# EasyEDA Pro project ProDoc_PCB5_2024-10-30.epro

# Board PCB5
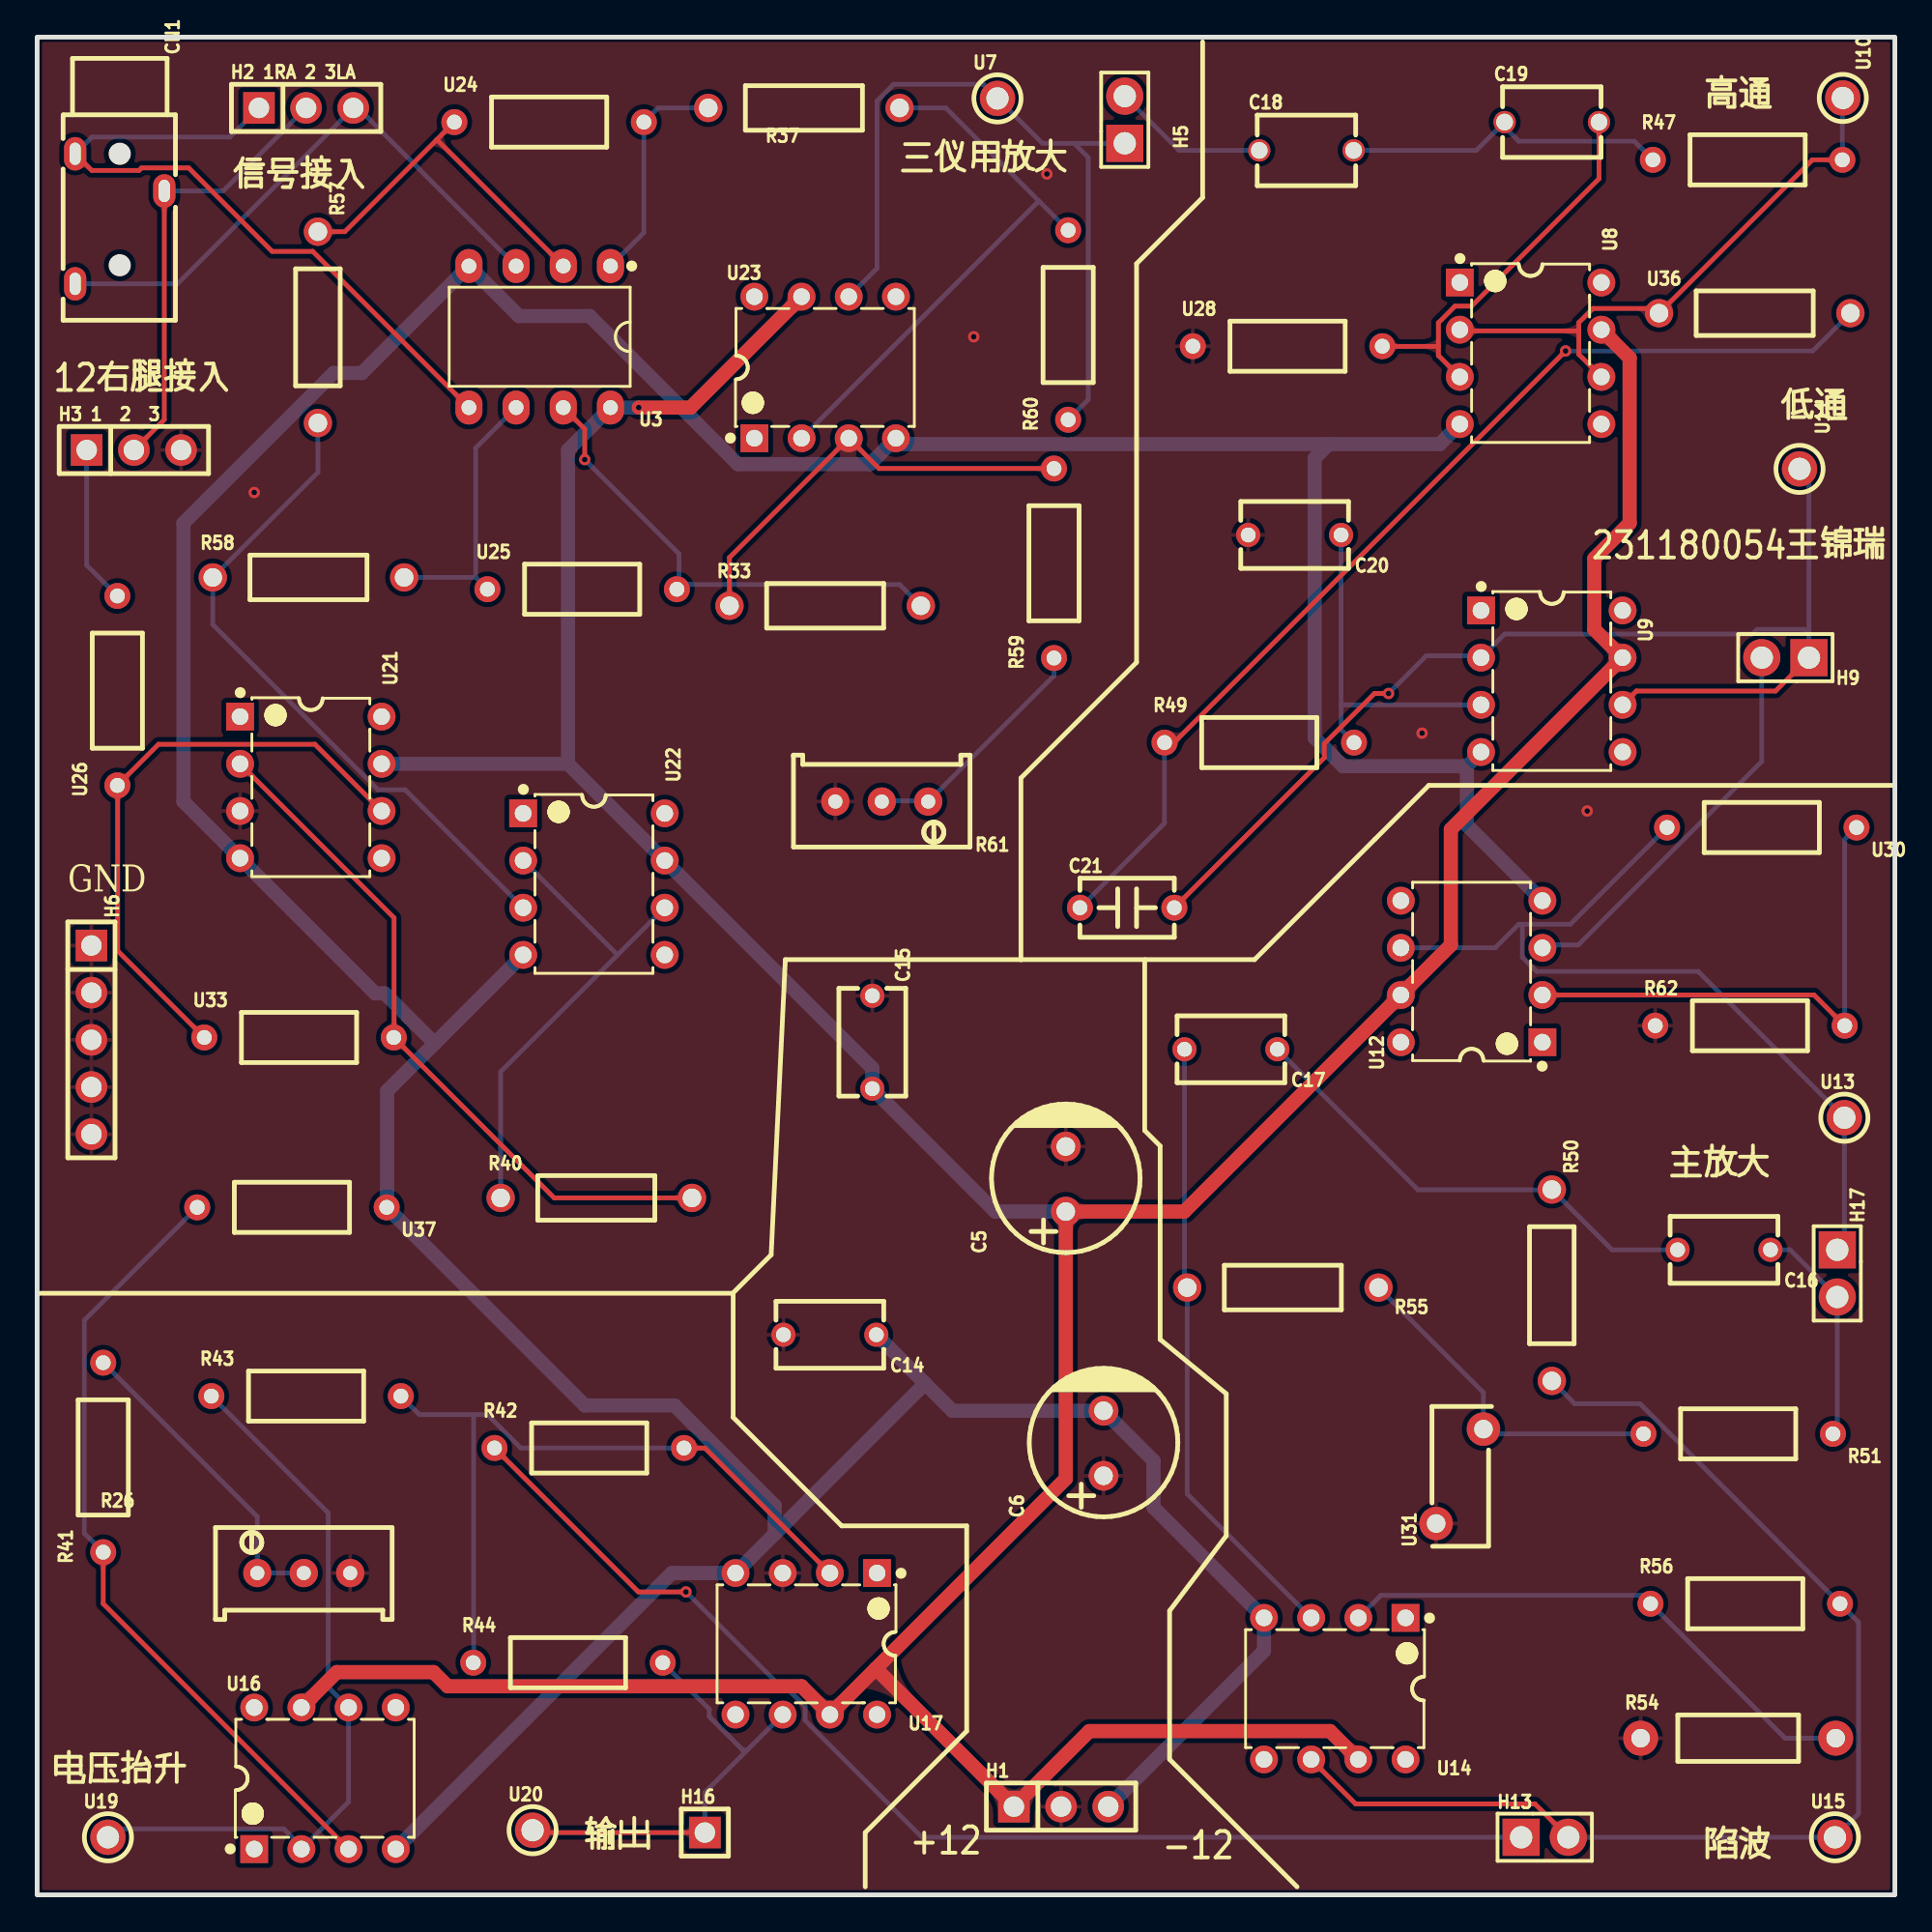
[diagram p0: board, top side]
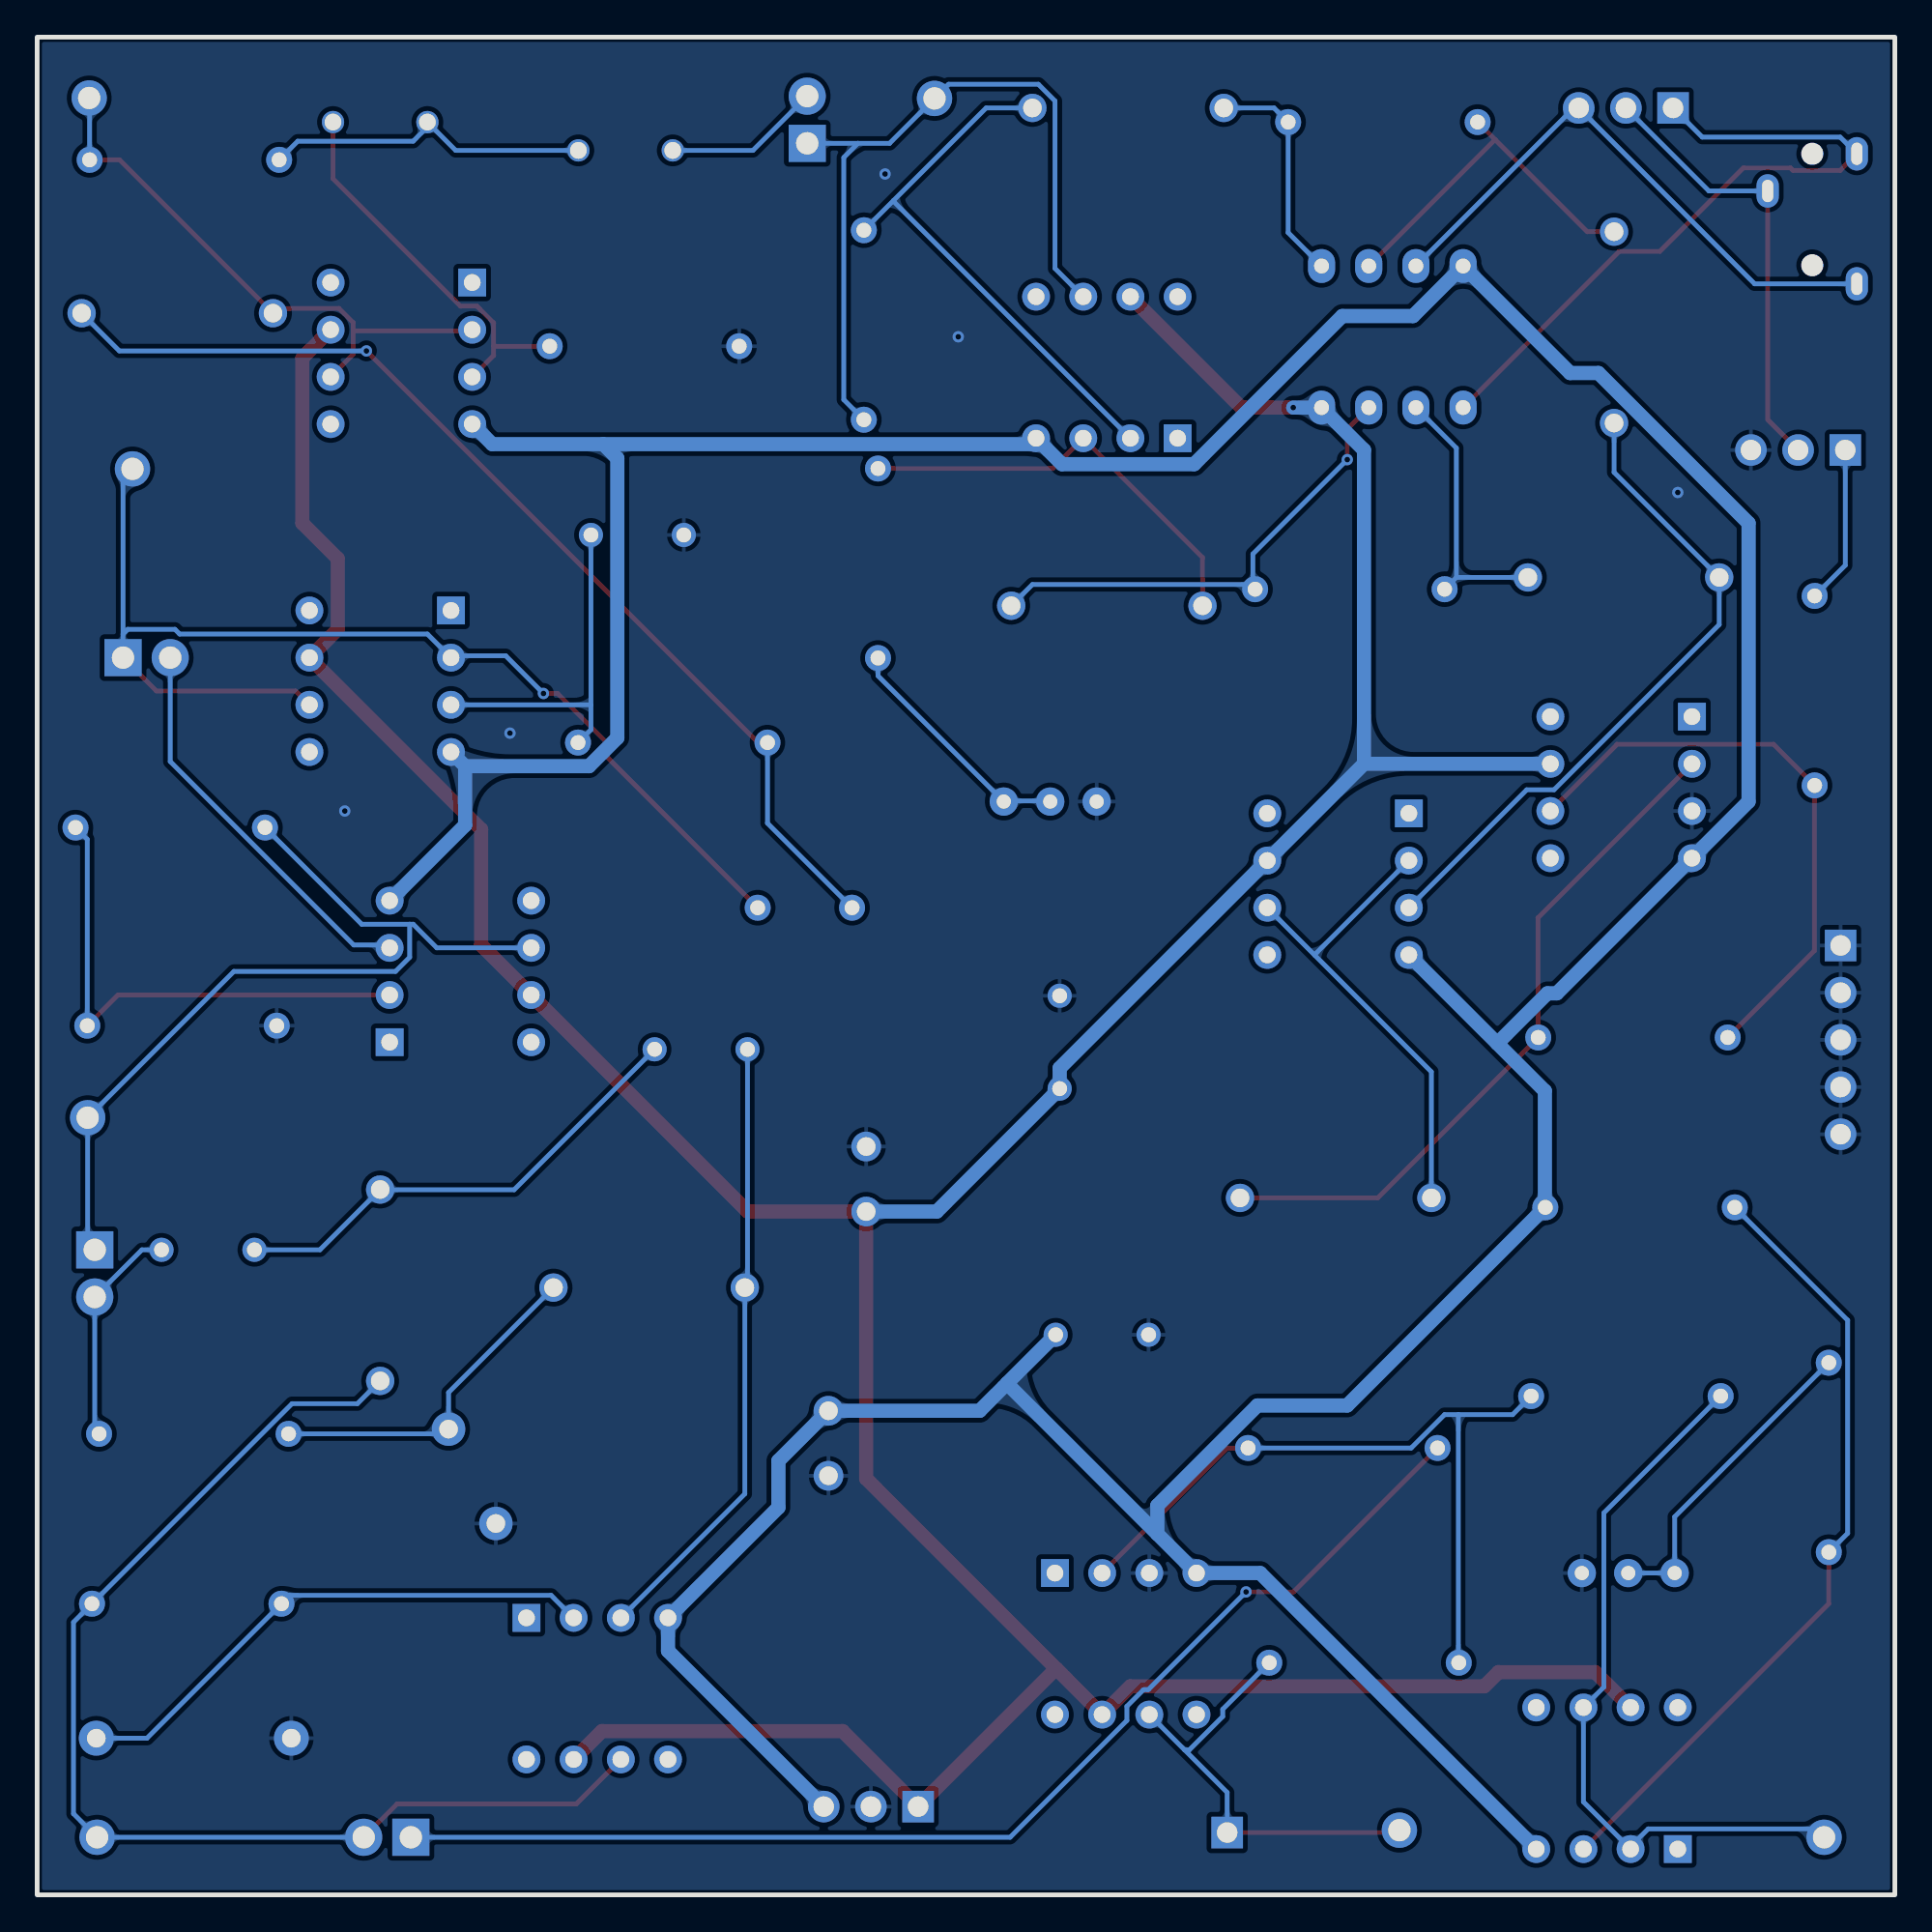
[diagram p1: board, bottom side, seen from below]

Outline 100 x 100 mm; copper layers: Top Layer, Bottom Layer. Coordinates in mm from the lower left corner of the outline.
Outline path: rectangle 0,100 100,0
Stack: Top Layer 0.035mm / Dielectric1 1.51mm FR4 er 4.5 / Bottom Layer 0.035mm

## Design rules (mm)
template: 自定义配置
spacing copperThickness1oz (default): track to track 0.102, other pairs 0.152 to 0.3
spacing copperThickness2oz: track to track 0.203, other pairs 0.152 to 0.3
track width copperThickness1oz (default): min 0.127, default 0.254, max 2.54
track width copperThickness2oz: min 0.203, default 0.254, max 2.54
track width 电源: min 0.762, default 0.762, max 0.762
differential pair differentialPair (default): width min 0.127, default 0.254, max 2.54; gap min 0.152, default 0.152
via viaSize (default): diameter min 0.5, default 0.61, max 10; hole min 0.3, default 0.305, max 6.299
net +12V uses 电源
net -12V uses 电源

## Placement (name value [footprint] x y rotation side)
C5  10uF  [CAP-TH_BD8.0-P3.50-D0.6-FD]  55.37 38.53 90 top
C6  10uF  [CAP-TH_BD8.0-P3.50-D0.6-FD]  57.4 24.31 90 top
C14  100nF  [CAP-TH_L5.8-W3.6-P5.0-D0.6]  42.67 30.15 180 top
C15  100nF  [CAP-TH_L5.8-W3.6-P5.0-D0.6]  44.96 45.9 270 top
C16  100nF  [CAP-TH_L5.8-W3.6-P5.0-D0.6]  90.8 34.72 180 top
C17  100nF  [CAP-TH_L5.8-W3.6-P5.0-D0.6]  64.26 45.52 180 top
C18  680nF  [CAP-TH_L5.3-W3.8-P5.08-D0.5]  68.33 93.9 0 top
C19  680nF  [CAP-TH_L5.3-W3.8-P5.08-D0.5]  81.53 95.43 0 top
C20  100nF  [CAP-TH_L5.8-W3.6-P5.0-D0.6]  67.69 73.2 180 top
C21  220nF  [CAP-TH_L5.0-W2.5-P5.08-D0.7]  58.67 53.14 0 top
CN1  PJ-3200  [AUDIO-TH_PJ-3200]  4.45 90.22 270 top
H1  PZ254V-11-03P  [HDR-TH_3P-P2.54-V-M]  55.12 4.75 0 top
H2 1RA 2 3LA  PZ254V-11-03P  [HDR-TH_3P-P2.54-V-M]  14.48 96.19 0 top
H3 1  2  3  -  [HDR-TH_3P-P2.54-V-M]  5.21 77.77 0 top
H5  PZ254V-11-02P  [HDR-TH_2P-P2.54-V-M]  58.55 95.55 90 top
H6  PZ254V-11-05P  [HDR-TH_5P-P2.54-V-M]  2.92 46.02 270 top
H9  PZ254V-11-02P  [HDR-TH_2P-P2.54-V-M]  94.11 66.6 180 top
H13  PZ254V-11-02P  [HDR-TH_2P-P2.54-V-M]  81.15 3.1 0 top
H16  PZ254V-11-01P  [HDR-TH_1P-P2.54-V-M]  35.94 3.35 0 top
H17  PZ254V-11-02P  [HDR-TH_2P-P2.54-V-M]  96.9 33.45 270 top
R26  10kΩ  [RES-ADJ-TH_3P-L10.0-W10.0-P2.50-L]  14.35 17.32 0 top
R33  10kΩ  [RES-TH_BD2.4-L6.3-P10.30-D0.6]  42.42 69.39 0 top
R37  10kΩ  [RES-TH_BD2.4-L6.3-P10.30-D0.6]  41.27 96.19 180 top
R40  10kΩ  [RES-TH_BD2.4-L6.3-P10.30-D0.6]  30.1 37.52 0 top
R41  20kΩ  [RES-TH_BD2.7-L6.2-P10.20-D0.4]  3.56 23.55 90 top
R42  1kΩ  [RES-TH_BD2.7-L6.2-P10.20-D0.4]  29.72 24.05 0 top
R43  1kΩ  [RES-TH_BD2.7-L6.2-P10.20-D0.4]  14.48 26.85 0 top
R44  1kΩ  [RES-TH_BD2.7-L6.2-P10.20-D0.4]  28.58 12.5 0 top
R47  1.8MΩ  [RES-TH_BD2.7-L6.2-P10.20-D0.4]  92.08 93.4 0 top
R49  13kΩ  [RES-TH_BD2.7-L6.2-P10.20-D0.4]  65.79 62.03 0 top
R50  16kΩ  [RES-TH_BD2.4-L6.3-P10.30-D0.6]  81.53 32.82 270 top
R51  33kΩ  [RES-TH_BD2.7-L6.2-P10.20-D0.4]  91.57 24.82 180 top
R54  3.9kΩ  [RES-TH_BD2.5-L6.5-P10.50-D0.6]  91.57 8.43 0 top
R55  30kΩ  [RES-TH_BD2.4-L6.3-P10.30-D0.6]  67.06 32.69 180 top
R56  3.3kΩ  [RES-TH_BD2.7-L6.2-P10.20-D0.4]  91.95 15.67 0 top
R57  10kΩ  [RES-TH_BD2.4-L6.3-P10.30-D0.6]  15.11 84.38 270 top
R58  10kΩ  [RES-TH_BD2.4-L6.3-P10.30-D0.6]  14.61 70.92 0 top
R59  20kΩ  [RES-TH_BD2.7-L6.2-P10.20-D0.4]  54.74 71.68 90 top
R60  20kΩ  [RES-TH_BD2.7-L6.2-P10.20-D0.4]  55.5 84.51 90 top
R61  10kΩ  [RES-ADJ-TH_3P-L10.0-W10.0-P2.50-L]  45.47 58.85 180 top
R62  1.5kΩ  [RES-TH_BD2.7-L6.2-P10.20-D0.4]  92.2 46.79 0 top
U3  LM358P  [DIP-8_L9.4-W6.4-P2.54-LS9.1-BL]  27.05 83.87 180 top
U7  RH-5000  [TEST-TH_BD2.54-P1.4_RED]  51.7 96.7 0 top
U8  OP07CP  [DIP-8_L9.6-W6.4-P2.54-LS7.6-BL-1]  80.39 82.98 270 top
U9  OP07CP  [DIP-8_L9.6-W6.4-P2.54-LS7.6-BL-1]  81.53 65.33 270 top
U10  RH-5000  [TEST-TH_BD2.54-P1.4_RED]  97.2 96.73 270 top
U11  RH-5000  [TEST-TH_BD2.54-P1.4_RED]  94.87 76.76 270 top
U12  OP07CP  [DIP-8_L9.6-W6.4-P2.54-LS7.6-BL-1]  77.22 49.71 90 top
U13  RH-5000  [TEST-TH_BD2.54-P1.4_RED]  97.28 41.83 0 top
U14  OP07CP  [DIP-8_L9.6-W6.4-P2.54-LS7.6-BL-1]  69.85 11.1 180 top
U15  RH-5000  [TEST-TH_BD2.54-P1.4_RED]  96.77 3.1 0 top
U16  OP07CP  [DIP-8_L9.6-W6.4-P2.54-LS7.6-BL-1]  15.49 6.27 0 top
U17  OP07CP  [DIP-8_L9.6-W6.4-P2.54-LS7.6-BL-1]  41.4 13.51 180 top
U19  RH-5000  [TEST-TH_BD2.54-P1.4_RED]  3.81 3.1 0 top
U20  RH-5000  [TEST-TH_BD2.54-P1.4_RED]  26.67 3.48 0 top
U21  OP07CP  [DIP-8_L9.6-W6.4-P2.54-LS7.6-BL-1]  14.73 59.61 270 top
U22  OP07CP  [DIP-8_L9.6-W6.4-P2.54-LS7.6-BL-1]  29.97 54.41 270 top
U23  OP07CP  [DIP-8_L9.6-W6.4-P2.54-LS7.6-BL-1]  42.42 82.22 0 top
U24  100kΩ  [RES-TH_BD2.7-L6.2-P10.20-D0.4]  27.56 95.43 0 top
U25  100kΩ  [RES-TH_BD2.7-L6.2-P10.20-D0.4]  29.34 70.28 0 top
U26  100kΩ  [RES-TH_BD2.7-L6.2-P10.20-D0.4]  4.32 64.82 90 top
U28  5.6MΩ  [RES-TH_BD2.7-L6.2-P10.20-D0.4]  67.31 83.36 0 top
U30  47kΩ  [RES-TH_BD2.7-L6.2-P10.20-D0.4]  92.84 57.45 180 top
U31  220nF  [CAP-TH_L7.5-W3.2-P5.08-D0.6]  76.58 22.53 90 top
U33  1MΩ  [RES-TH_BD2.7-L6.2-P10.20-D0.4]  14.1 46.15 0 top
U36  12kΩ  [RES-TH_BD2.4-L6.3-P10.30-D0.6]  92.46 85.14 0 top
U37  130kΩ  [RES-TH_BD2.7-L6.2-P10.20-D0.4]  13.72 37.01 180 top

## Footprints (pads in the part's own frame, mm; a bottom-side part is the same pattern mirrored in y, then rotated)
AUDIO-TH_PJ-3200
  oval 1.8x1.2 hole 1.2x0.6: 2(-1.5,2.4) 3(-3.5,-2.4) 4(3.5,-2.4)
CAP-TH_BD8.0-P3.50-D0.6-FD
  round 1.6 hole 1: 1(-1.75,0) 2(1.75,0)
CAP-TH_L5.0-W2.5-P5.08-D0.7
  round 1.4 hole 0.8: 1(-2.54,0) 2(2.54,0)
CAP-TH_L5.3-W3.8-P5.08-D0.5
  round 1.2 hole 0.9: 1(-2.54,0) 2(2.54,0)
CAP-TH_L5.8-W3.6-P5.0-D0.6
  round 1.3 hole 0.8: 1(-2.5,0) 2(2.5,0)
CAP-TH_L7.5-W3.2-P5.08-D0.6
  round 1.8 hole 1: 1(-2.54,1.274) 2(2.54,-1.274)
DIP-8_L9.4-W6.4-P2.54-LS9.1-BL
  oval 1.46x1.825 hole 0.8: 1(-3.81,-3.81) 2(-1.27,-3.81) 3(1.27,-3.81) 4(3.81,-3.81) 5(3.81,3.81) 6(1.27,3.81) 7(-1.27,3.81) 8(-3.81,3.81)
DIP-8_L9.6-W6.4-P2.54-LS7.6-BL-1
  rect 1.5x1.5 hole 0.9: 1(-3.81,-3.81)
  round 1.5 hole 0.9: 2(-1.27,-3.81) 3(1.27,-3.81) 4(3.81,-3.81) 5(3.81,3.81) 6(1.27,3.81) 7(-1.27,3.81) 8(-3.81,3.81)
HDR-TH_1P-P2.54-V-M
  rect 1.7x1.7 hole 1.1: 1(0,0)
HDR-TH_2P-P2.54-V-M
  rect 2x2 hole 1.2: 1(-1.27,0)
  round 2 hole 1.2: 2(1.27,0)
HDR-TH_3P-P2.54-V-M
  rect 1.7x1.7 hole 1.1: 1(-2.54,0)
  round 1.7 hole 1.1: 2(0,0) 3(2.54,0)
HDR-TH_5P-P2.54-V-M
  rect 1.7x1.7 hole 1.1: 1(-5.08,0)
  round 1.7 hole 1.1: 2(-2.54,0) 3(0,0) 4(2.54,0) 5(5.08,0)
RES-ADJ-TH_3P-L10.0-W10.0-P2.50-L
  round 1.524 hole 0.762: 1(-2.5,0) 2(0,0) 3(2.5,0)
RES-TH_BD2.4-L6.3-P10.30-D0.6
  round 1.524 hole 1: 1(-5.15,0) 2(5.15,0)
RES-TH_BD2.5-L6.5-P10.50-D0.6
  round 1.879 hole 1: 1(-5.25,0) 2(5.25,0)
RES-TH_BD2.7-L6.2-P10.20-D0.4
  round 1.4 hole 0.8: 1(-5.1,0) 2(5.1,0)
TEST-TH_BD2.54-P1.4_RED
  round 1.9 hole 1.2: 1(0,0)

## Nets
+12V: C5.1 C15.2 H1.1 U3.8 U8.7 U9.7 U12.7 U14.7 U16.7 U17.7 U21.7 U22.7 U23.7
-12V: C6.2 C14.1 H1.3 U3.4 U8.4 U9.4 U12.4 U14.4 U16.4 U17.4 U21.4 U22.4 U23.4 U37.1
GND: C5.2 C6.1 C14.2 C15.1 C20.2 H1.2 H3 1  2  3.3 H6.1 H6.2 H6.3 H6.4 H6.5 R26.3 R54.1 R61.3 R62.1 U17.3 U21.3 U28.1 U31.1
$1N1302: CN1.2 H2 1RA 2 3LA.2 H3 1  2  3.2
$1N1303: CN1.4 H2 1RA 2 3LA.3 U3.3
$1N1305: R37.1 R60.2 U23.2
$1N1306: H5.1 R60.1 U7.1 U23.6
$1N1308: R37.2 U3.1 U24.2
$1N1309: R57.1 U3.2 U24.1
$1N1310: R33.2 U3.7 U25.2
$1N1312: R33.1 R59.2 U23.3
$1N1313: R59.1 R61.1 R61.2
$1N1314: R57.2 R58.1 U22.3
$1N1315: R40.1 U22.2 U22.6
$1N1317: R40.2 U21.2 U33.2
$1N1318: H3 1  2  3.1 U26.2
$1N1319: U21.6 U26.1 U33.1
$1N1321: R58.2 U3.6 U25.1
$1N1327: CN1.3 H2 1RA 2 3LA.1 U3.5
$1N1922: C18.1 H5.2
$1N1923: C19.2 U8.3 U28.2
$1N1927: C18.2 C19.1 R47.1
$1N1933: R47.2 U8.2 U8.6 U10.1 U36.1
$1N1934: C21.2 H9.1 U9.2 U9.6 U11.1
$1N1935: C21.1 R49.1 U36.2
$1N1937: C20.1 R49.2 U9.3
$1N2912: H9.2 U12.3
$1N2915: R62.2 U12.2 U30.1
$1N2917: R51.2 R55.1 U31.2
$1N2918: C16.2 C17.1 R50.1
$1N2919: C17.2 R55.2 U14.3
$1N2920: R54.2 R56.1 U14.2
$1N2921: H13.2 R50.2 R56.2 U14.6 U15.1
$1N4245: R41.1 U16.3 U37.2
$1N4250: R26.1 R26.2 R41.2
$1N4251: R43.1 U16.2 U16.6 U19.1
$1N4261: H13.1 R42.1
$1N4264: R42.2 R43.2 R44.1 U17.2
$1N4272: H16.1 R44.2 U17.6 U20.1
$1N8474: C16.1 H17.2 R51.1
$1N8480: H17.1 U12.6 U13.1 U30.2

Pads without a net: U8 1 5 8; U9 1 5 8; U12 1 5 8; U14 1 5 8; U16 1 5 8; U17 1 5 8; U21 1 5 8; U22 1 5 8; U23 1 5 8

## Via types
v1: diameter 0.61, hole 0.305, Top Layer to Bottom Layer, 10 vias

## Routing (per net, layer and track width the routed paths; a pad name or vN(x,y) marks a point on that pad's centre or on a via; arc(x,y) is an arc through that point)
+12V: length 239.9
  Top Layer w0.762: v1(32.39,80.06) 35.18,80.06 U23.7 ; 45.13,12.17 45.16,12.17 H1.1 56.64,8.81 69.6,8.81 U14.7 ; 45.13,12.17 U17.7 41.15,11.23 22.1,11.23 21.34,11.99 16.13,11.99 U16.7 ; 45.13,12.17 55.37,22.4 C5.1 61.75,36.78 U12.7 76.1,51.13 76.1,57.35 U9.7 83.82,68.12 83.82,71.93 85.73,73.84 85.73,82.73 84.2,84.25
  Bottom Layer w0.762: 28.58,60.88 28.58,77.77 U3.8 v1(32.39,80.06) ; 28.58,60.88 U21.7 ; 28.58,60.88 U22.7 44.96,44.5 C15.2 51.57,36.78 C5.1
-12V: length 275.9
  Bottom Layer w0.762: H1.3 66.04,13.13 U14.4 60.1,20.85 60.1,23.36 C6.2 49.26,26.06 47.78,27.54 ; 18.84,36.98 29.48,26.34 34.31,26.34 39.7,20.95 39.7,19.43 ; 18.84,36.98 18.84,43.27 21.4,45.83 ; 18.84,36.98 U37.1 ; 45.91,78.09 44.83,77.01 37.72,77.01 29.75,84.99 25.94,84.99 U3.4 17.48,81.92 15.96,81.92 7.87,73.84 7.87,58.85 U21.4 18.2,48.53 18.7,48.53 21.4,45.83 ; 45.91,78.09 69.53,78.09 ; 45.91,78.09 U23.4 ; 39.7,19.43 47.78,27.51 47.78,27.54 ; 39.7,19.43 U17.4 34.16,17.32 U16.4 ; 76.96,60.76 70.29,60.76 68.77,62.28 68.77,77.33 69.53,78.09 ; 76.96,60.76 U9.4 ; 76.96,60.76 76.96,57.58 U12.4 ; 76.58,79.17 75.5,78.09 69.53,78.09 ; 21.4,45.83 U22.4 ; 47.78,27.54 C14.1
GND:
  vias: v1(11.68,75.49) v1(50.42,83.87) v1(54.36,92.63) v1(74.55,62.53) v1(83.44,58.34)
$1N1302: length 24.1
  Top Layer w0.254: CN1.2 6.84,79.41 H3 1  2  3.2
  Bottom Layer w0.254: H2 1RA 2 3LA.2 10.01,91.72 CN1.2
$1N1303: length 31.2
  Bottom Layer w0.254: CN1.4 7.55,86.72 H2 1RA 2 3LA.3 17.27,96.19 U3.3
$1N1305: length 29.9
  Bottom Layer w0.254: U23.2 53.9,91.16 53.9,91.21 ; 53.9,91.21 R60.2 ; 53.9,91.21 48.92,96.19 R37.1
$1N1306: length 41.8
  Bottom Layer w0.254: 55.82,94.28 56.58,93.52 56.58,80.49 R60.1 ; 55.82,94.28 54.11,94.28 U7.1 50.93,97.46 46.11,97.46 45.21,96.57 45.21,87.55 U23.6 ; 55.82,94.28 H5.1
$1N1308: length 12.3
  Bottom Layer w0.254: U3.1 32.66,89.48 U24.2 33.42,96.19 36.13,96.19
$1N1309: length 19.4
  Top Layer w0.254: 21.5,94.47 21.53,94.47 U3.2 ; 21.5,94.47 16.56,89.53 R57.1 ; 21.5,94.47 22.46,95.43
$1N1310: length 26
  Top Layer w0.254: U3.7 29.48,78.91 v1(29.48,77.26)
  Bottom Layer w0.254: 34.56,70.4 34.56,72.18 v1(29.48,77.26) ; 34.56,70.4 U25.2 ; 34.56,70.4 34.69,70.54 46.42,70.54 R33.2
$1N1312: length 23.4
  Top Layer w0.254: R59.2 45.32,76.78 U23.3 37.27,71.99 R33.1
$1N1313: length 13.1
  Bottom Layer w0.254: R59.1 54.74,65.62 48,58.89 ; 48,58.89 R61.1 ; 48,58.89 45.5,58.89 R61.2
$1N1314: length 36.2
  Bottom Layer w0.254: R57.2 15.11,76.57 R58.1 9.45,68.38 18.34,59.49 19.81,59.49 U22.3
$1N1315: length 26.5
  Bottom Layer w0.254: U22.2 31.23,50.6 31.23,50.59 ; 31.23,50.59 24.95,44.3 R40.1 ; 31.23,50.59 U22.6
$1N1317: length 37.8
  Top Layer w0.254: 19.21,46.14 19.21,52.59 U21.2 ; 19.21,46.14 U33.2 ; 19.21,46.14 27.83,37.52 R40.2
$1N1318: length 8.5
  Bottom Layer w0.254: H3 1  2  3.1 2.67,71.57 U26.2
$1N1319: length 32.1
  Top Layer w0.254: 4.33,59.74 U26.1 ; 4.33,59.74 4.33,50.82 U33.1 ; 4.33,59.74 6.53,61.94 14.95,61.94 U21.6
$1N1321: length 14.8
  Bottom Layer w0.254: 23.6,70.92 23.6,77.88 U3.6 ; 23.6,70.92 R58.2 ; 23.6,70.92 U25.1
$1N1327: length 37.9
  Top Layer w0.254: U3.5 14.83,88.47 12.65,88.47 8.16,92.96 5.62,92.96 5.48,92.82 2.94,92.82 CN1.3
  Bottom Layer w0.254: CN1.3 2.94,94.62 10.37,94.62 H2 1RA 2 3LA.1
$1N1922: length 8.4
  Bottom Layer w0.254: C18.1 61.47,93.9 H5.2
$1N1923: length 21.3
  Top Layer w0.254: 75.43,83.35 75.43,82.86 U8.3 ; 75.43,83.35 75.43,84.62 76.33,85.52 77.22,85.52 84.07,92.38 C19.2 ; 75.43,83.35 72.42,83.35 U28.2
$1N1927: length 17.7
  Bottom Layer w0.254: 78.86,95.3 77.47,93.9 C18.2 ; 78.86,95.3 C19.1 ; 78.86,95.3 79.76,94.4 85.97,94.4 R47.1
$1N1933: length 31.2
  Top Layer w0.254: R47.2 95.56,93.4 U36.1 87.05,85.39 83.75,85.39 82.99,84.63 82.99,84.19 ; U8.6 82.99,82.92 82.99,84.19 ; 82.99,84.19 76.64,84.19 76.58,84.25
  Bottom Layer w0.254: U10.1 97.17,96.7 R47.2
$1N1934: length 62.5
  Top Layer w0.254: C21.2 69.29,61.21 69.29,61.98 71.98,64.67 v1(72.75,64.67) ; H9.1 93.58,64.8 86.09,64.8 U9.6
  Bottom Layer w0.254: H9.1 95.38,67.87 ; 95.38,67.87 95.38,76.25 U11.1 ; 95.38,67.87 95.12,68.12 92.58,68.12 92.33,67.87 78.99,67.87 77.83,66.7 ; 77.83,66.7 U9.2 ; 77.83,66.7 74.78,66.7 v1(72.75,64.67)
$1N1935: length 57.3
  Top Layer w0.254: R49.1 61.19,62.03 v1(82.28,83.11)
  Bottom Layer w0.254: R49.1 60.69,57.69 C21.1 ; U36.2 95.57,83.11 v1(82.28,83.11)
$1N1937: length 19
  Bottom Layer w0.254: C20.1 70.19,64.06 ; 70.19,64.06 U9.3 ; 70.19,64.06 70.19,62.72 R49.2
$1N2912: length 21.6
  Bottom Layer w0.254: H9.2 92.84,61.01 82.96,51.13 81.18,51.13 U12.3
$1N2915: length 27.9
  Top Layer w0.254: U12.2 95.65,48.44 R62.2
  Bottom Layer w0.254: U30.1 97.3,56.82 R62.2
$1N2917: length 18.7
  Bottom Layer w0.254: R51.2 78.11,24.82 U31.2 77.85,27.04 R55.1
$1N2918: length 26
  Bottom Layer w0.254: 81.55,37.95 74.32,37.95 C17.1 ; 81.55,37.95 R50.1 ; 81.55,37.95 84.78,34.72 C16.2
$1N2919: length 33.4
  Bottom Layer w0.254: U14.3 61.91,21.58 R55.2 61.76,32.83 C17.2
$1N2920: length 29.4
  Bottom Layer w0.254: U14.2 72.33,16.12 86.39,16.12 R56.1 94.09,8.43 R54.2
$1N2921: length 63.9
  Top Layer w0.254: H13.2 80.63,4.89 70.98,4.89 U14.6
  Bottom Layer w0.254: R50.2 82.76,26.44 86.28,26.44 R56.2 98.04,14.68 98.04,4.37 U15.1 H13.2
$1N4245: length 43
  Top Layer w0.254: R41.1 3.56,15.67 U16.3
  Bottom Layer w0.254: R41.1 2.54,19.46 2.54,30.93 U37.2
$1N4250: length 17.3
  Bottom Layer w0.254: R41.2 11.85,20.35 R26.1 R26.2
$1N4251: length 39.6
  Bottom Layer w0.254: 14.29,2.53 U16.2 ; 14.29,2.53 13.28,3.55 4.26,3.55 U19.1 ; 14.29,2.53 16.76,5 U16.6 15.66,11.18 15.66,20.56 R43.1
$1N4261: length 64.4
  Top Layer w0.254: v1(34.92,16.31) 32.36,16.31 R42.1
  Bottom Layer w0.254: H13.1 47.63,3.1 41.34,9.38 41.34,10.15 40.44,11.04 40.19,11.04 v1(34.92,16.31)
$1N4264: length 40.4
  Top Layer w0.254: R42.2 35.94,24.05 U17.2
  Bottom Layer w0.254: 23.5,25.85 20.58,25.85 R43.2 ; 23.5,25.85 24.24,25.85 26.04,24.05 R42.2 ; 23.5,25.85 23.5,12.52 R44.1
$1N4272: length 24.1
  Top Layer w0.254: H16.1 26.8,3.35 U20.1
  Bottom Layer w0.254: 38.23,7.8 U17.6 ; 38.23,7.8 37.98,7.8 36.18,9.6 36.18,9.99 R44.2 ; 38.23,7.8 35.94,5.51 H16.1
$1N8474: length 12.1
  Bottom Layer w0.254: R51.1 96.9,25.05 H17.2 94.36,34.72 C16.1
$1N8480: length 47
  Bottom Layer w0.254: 79.95,52.25 79.95,50.47 80.71,49.71 89.41,49.71 U13.1 97.28,35.1 H17.1 ; 79.95,52.25 79.76,52.25 78.49,50.98 U12.6 ; 79.95,52.25 82.53,52.25 U30.2

## Copper pours and planes (outline as drawn; the poured copper is in the pictures)
GND on Top Layer: -2.03,102.03 103.38,102.03 103.38,-1.73 -2.03,-1.73
GND on Bottom Layer: -4.44,104.06 104.27,104.06 104.27,-5.92 -4.44,-5.92

Small or netless copper shapes (teardrops, artwork), in the pictures only: 65 on Top Layer, 158 on Bottom Layer

## Text on the board
Top Silkscreen Layer: +12 | -12 | 12右腿接入 | 电压抬升 | GND | 信号接入 | 输出 | 三仪用放大 | 主放大 | 高通 | 陷波 | 低通 | 231180054王锦瑞
